# Altium project CW308T_STM32F415_CSP.PrjPcb
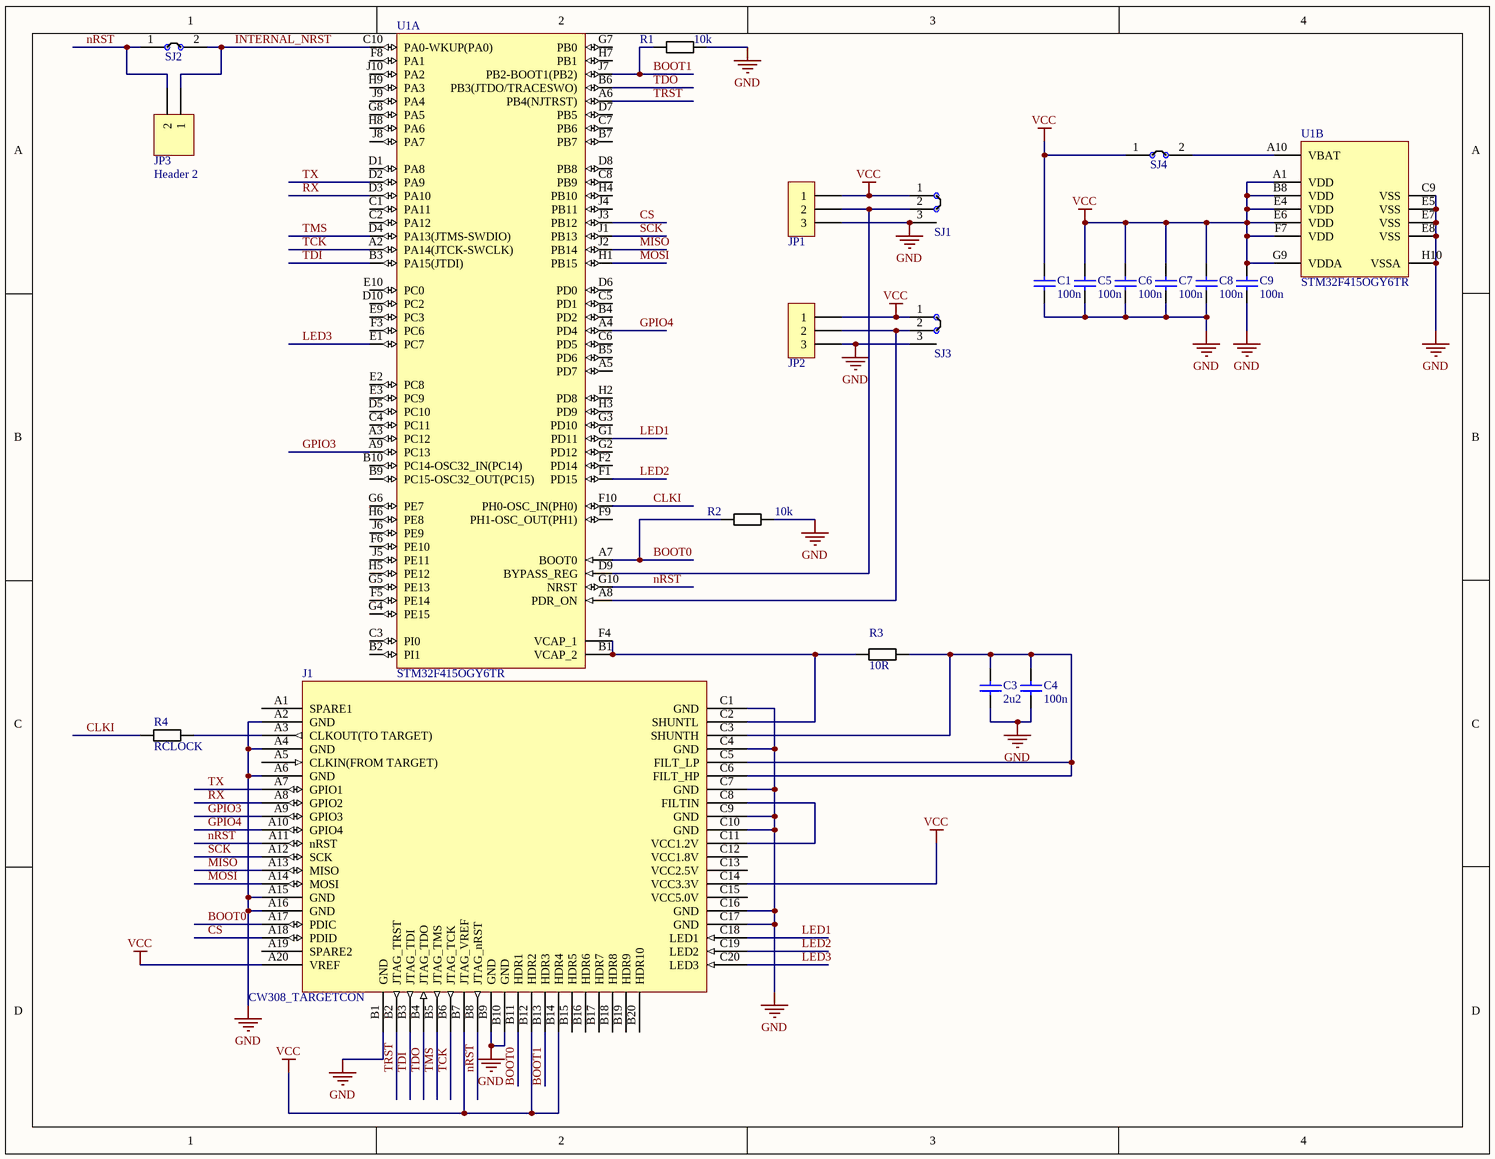
[diagram p0: CW308T_STM32F415_Micro.SchDoc]
PrjLicense: GPL; PrjName: STM32F 64QFP Target; PrjRev: 03
1 sheet, 21 parts. Net scope: global (net labels, ports and power ports of the same name join across sheets).
Board files: CW308T_STM32F415_CSP.PcbDoc, CW308T_STM32415_PANEL.PcbDoc

## Sheet CW308T_STM32F415_Micro.SchDoc: STM32F UFO Target
size Letter; Organization: NewAE Technology Inc.; Address1: 1083 Queen St., Suite 196; Address2: Halifax; Address3: NS; Address4: Canada B3H 0B2; SheetApproved: YES

### Parts
C1  100n  [CAPC0603_M]
C3  2u2  [CAPC0603_M]
C4  100n  [CAPC0603_M]
C5  100n  [CAPC0603_M]
C6  100n  [CAPC0603_M]
C7  100n  [CAPC0603_M]
C8  100n  [CAPC0603_M]
C9  100n  [CAPC0603_M]
J1  CW308_TARGETCON  [CW308_SMD_TBOARD_CONN_BOTTOM]
JP1  Straight Header Pins  [1x3_SMD_Straight_pins]  (value not drawn)
JP2  Straight Header Pins  [1x3_SMD_Straight_pins]  (value not drawn)
JP3  Header 2  [1x2_SMD_Straight_pins]
R1  10k  [RESC1608X55N]
R2  10k  [RESC1608X55N]
R3  10R  [RESC1608X55N]
R4  RCLOCK  [RESC1608X55N]
SJ1  NC  [SJ_3S_NC12]  (value not drawn)  (no BOM)
SJ2  NC  [SJ_2S_NC]  (value not drawn)  (no BOM)
SJ3  NC  [SJ_3S_NC12]  (value not drawn)  (no BOM)
SJ4  NC  [SJ_2S_NC]  (value not drawn)  (no BOM)
U1  STM32F415OGY6TR  [STM-WLCSP90]  (parts A,B of 2)

### Nets
GND: C1.2 C3.2 C4.2 C5.2 C6.2 C7.2 C8.2 C9.2 J1.A2(GND) J1.A4(GND) J1.A6(GND) J1.A15(GND) J1.A16(GND) J1.B1(GND) J1.B9(GND) J1.B10(GND) J1.C1(GND) J1.C4(GND) J1.C7(GND) J1.C9(GND) J1.C10(GND) J1.C16(GND) J1.C17(GND) JP1.3 JP2.3 R1.2 R2.2 SJ1.3 SJ3.3 U1.C9(VSS) U1.E5(VSS) U1.E7(VSS) U1.E8(VSS) U1.H10(VSSA)
VCC: C1.1 C5.1 C6.1 C7.1 C8.1 C9.1 J1.A20(VREF) J1.B7(JTAG_VREF) J1.B12(HDR2) J1.B14(HDR4) J1.C14(VCC3.3V) JP1.1 JP2.1 SJ1.1 SJ3.1 SJ4.1 U1.A1(VDD) U1.B8(VDD) U1.E4(VDD) U1.E6(VDD) U1.F7(VDD) U1.G9(VDDA)
BOOT0: J1.A17(PDIC) J1.B11(HDR1) R2.1 U1.A7(BOOT0)
BOOT1: J1.B13(HDR3) R1.1 U1.J7(PB2-BOOT1(PB2))
CLKI: R4.1 U1.F10(PH0-OSC_IN(PH0))
CS: J1.A18(PDID) U1.J3(PB12)
GPIO3: J1.A9(GPIO3) U1.A9(PC13)
GPIO4: J1.A10(GPIO4) U1.A4(PD4)
INTERNAL_NRST: JP3.1 SJ2.2 U1.C10(PA0-WKUP(PA0))
LED1: J1.C18(LED1) U1.G1(PD11)
LED2: J1.C19(LED2) U1.F1(PD15)
LED3: J1.C20(LED3) U1.E1(PC7)
MISO: J1.A13(MISO) U1.J2(PB14)
MOSI: J1.A14(MOSI) U1.H1(PB15)
nRST: J1.A11(nRST) J1.B8(JTAG_nRST) JP3.2 SJ2.1 U1.G10(NRST)
RX: J1.A8(GPIO2) U1.D3(PA10)
SCK: J1.A12(SCK) U1.J1(PB13)
TCK: J1.B6(JTAG_TCK) U1.A2(PA14(JTCK-SWCLK))
TDI: J1.B3(JTAG_TDI) U1.B3(PA15(JTDI))
TDO: J1.B4(JTAG_TDO) U1.B6(PB3(JTDO/TRACESWO))
TMS: J1.B5(JTAG_TMS) U1.D4(PA13(JTMS-SWDIO))
TRST: J1.B2(JTAG_TRST) U1.A6(PB4(NJTRST))
TX: J1.A7(GPIO1) U1.D2(PA9)
NetC3_1: C3.1 C4.1 J1.C3(SHUNTH) J1.C5(FILT_LP) J1.C6(FILT_HP) R3.2
NetJ1_A3: J1.A3(CLKOUT(TO_TARGET)) R4.2
NetJ1_C2: J1.C2(SHUNTL) R3.1 U1.B1(VCAP_2) U1.F4(VCAP_1)
NetJ1_C8: J1.C8(FILTIN) J1.C11(VCC1.2V)
NetJP1_2: JP1.2 SJ1.2 U1.D9(BYPASS_REG)
NetJP2_2: JP2.2 SJ3.2 U1.A8(PDR_ON)
NetSJ4_2: SJ4.2 U1.A10(VBAT)

Not connected (* = marked no-connect by the designer): J1 A1(SPARE1) A5(CLKIN(FROM_TARGET)) A19(SPARE2) B15(HDR5) B16(HDR6) B17(HDR7) B18(HDR8) B19(HDR9) B20(HDR10) C12(VCC1.8V) C13(VCC2.5V) C15(VCC5.0V); U1 A3(PC12) A5(PD7) B2(PI1) B4(PD2) B5(PD6) B7(PB7) B9(PC15-OSC32_OUT(PC15)) B10(PC14-OSC32_IN(PC14)) C1(PA11) C2(PA12) C3(PI0) C4(PC11) C5(PD1) C6(PD5) C7(PB6) C8(PB9) D1(PA8) D5(PC10) D6(PD0) D7(PB5) D8(PB8) D10(PC2) E2(PC8) E3(PC9) E9(PC3) E10(PC0) F2(PD14) F3(PC6) F5(PE14) F6(PE10) F8(PA1) F9(PH1-OSC_OUT(PH1)) G2(PD12) G3(PD10) G4(PE15) G5(PE13) G6(PE7) G7(PB0) G8(PA5) H2(PD8) H3(PD9) H4(PB10) H5(PE12) H6(PE8) H7(PB1) H8(PA6) H9(PA3) J4(PB11) J5(PE11) J6(PE9) J8(PA7) J9(PA4) J10(PA2)

### Library data of the parts
C1 C4-C9 = CCHIP-100n-0603: 100n, 0603; Component Group: Capacitor; Case-EIA: 0603; Case-Metric: 1608; Part Number: CCHIP-100n-0603; Footprint: 0603; Pin Count: 2; Value: 100n; Mounting Technology: SMT; Component Kind: Standard; Component Type: Standard
C3 = CCHIP-2u2-0603: 2u2, 0603; Component Group: Capacitor; Case-EIA: 0603; Case-Metric: 1608; Part Number: CCHIP-2u2-0603; Footprint: 0603; Pin Count: 2; Value: 2u2; Mounting Technology: SMT; Component Kind: Standard; Component Type: Standard
J1 = CW308_TBOARD: CW308 "Standard" Target Board Connector; Component Group: Mechanical; Pitch: 2.54mm; Part Number: CW308_TBOARD; Pin Count: 60; Mounting Technology: Through-hole; Component Kind: Standard; Component Type: Standard
JP1 JP2 = HDR_3PIN: 1x3 Straight pin header; Manufacture 1: Wurth Electronics Inc.; Manufacture Part Number 1: 61300311121; Component Group: Connector; PP Material Stack: 0; Part Number: HDR_3PIN; Footprint: 1x3_Straight_pins; Pin Count: 3; Supplier 1: Digi-Key; Supplier Part Number 1: 732-5316-ND; Mounting Technology: Through-hole; RoHS: Yes; Component Kind: Standard; Component Type: Standard; PP Rotation: 0
JP3 = Header 2: Header, 2-Pin; LatestRevisionDate: 17-Jul-2002; LatestRevisionNote: Re-released for DXP Platform.; Publisher: Altium Limited
R1 R2 = RCHIP-10K-0603: 10k res, 0603, 1%, 1/10W; Manufacture 1: Yageo; Manufacture Part Number 1: RC0603FR-0710KL; Component Group: Resistor; Case-EIA: 0603; Case-Metric: 1608; Rated Power: 0.1W; Rated Voltage: 75VDC; Part Number: RCHIP-10K-0603; Footprint: 0603; Pin Count: 2; Supplier 1: Digi-Key; Supplier Part Number 1: 311-10.0KHRCT-ND; Value: 10k; Tolerance: 1%; Mounting Technology: SMT; Temperature Range: -55C to 155C; Component Kind: Standard; Component Type: Standard
R3 = RCHIP-10R-0603: 10R res, 0603, 1%, 1/10W; Manufacture 1: Yageo; Manufacture Part Number 1: RC0603FR-0710RL; Component Group: Resistor; Case-EIA: 0603; Case-Metric: 1608; Rated Power: 0.1W; Rated Voltage: 75VDC; Part Number: RCHIP-10R-0603; Footprint: 0603; Pin Count: 2; Supplier 1: Digi-Key; Supplier Part Number 1: 311-10.0HRCT-ND; Value: 10R; Tolerance: 1%; Mounting Technology: SMT; Temperature Range: -55C to 155C; Component Kind: Standard; Component Type: Standard
R4 = RCHIP-100R-0603: 100R res, 0603, 1%, 1/10W; Manufacture 1: Yageo; Manufacture Part Number 1: RC0603FR-07100RL; Component Group: Resistor; Case-EIA: 0603; Case-Metric: 1608; Rated Power: 0.1W; Rated Voltage: 75VDC; Part Number: RCHIP-100R-0603; Footprint: 0603; Pin Count: 2; Supplier 1: Digi-Key; Supplier Part Number 1: 311-100HRCT-ND; Value: 100R; Tolerance: 1%; Mounting Technology: SMT; Temperature Range: -55C to 155C; Component Kind: Standard; Component Type: Standard
SJ1 SJ3 = SJ_3S_12JMP: Solder Jumper, NC; Component Group: PCB Feature; Part Number: SJ_3S_12JMP; Pin Count: 3; Mounting Technology: COPPER; Component Type: Standard (No BOM)
SJ2 SJ4 = SJ_2S: Solder Jumper, NC; Component Group: PCB Feature; Part Number: SJ_2S; Pin Count: 2; Mounting Technology: COPPER; Component Type: Standard (No BOM)
U1 = CMP-0243-00132-2: ARM Cortex-M4 32-bit MCU+FPU, 210 DMIPS, 1024 kB Flash, 192 kB Internal RAM, 72 I/Os, 90-pin WLCSP, -40 to 85 degC, Tape and Reel; Manufacturer: STMicroelectronics; I/Os (High Current): 72; Supply Voltage(Vcc) max (V): 3.6; Supply Voltage(Vcc) min (V): 1.8; FLASH Size (Prog) (kB): 1024; D/A Converter: 2x12-bit; Internal RAM Size (kB): 192; Operating Frequency(F) (Processor speed) (MHz): 168; PartNumber: STM32F415OGY6TR; Core: ARM Cortex-M4; Mounting Technology: Surface Mount; Packing: Tape and Reel; PackageDescription: 90-Ball Wafer Level Chip Size Package, 0.4 mm Pitch; ComponentLink1URL: http://www.st.com/web/en/home.html; PackageReference: WLCSP90; ComponentLink3URL: http://www.st.com/st-web-ui/static/active/en/resource/technical/document/datasheet/DM00035129.pdf; ComponentLink3Description: Package Specification; DatasheetVersion: Rev. 4; ComponentLink2Description: Datasheet; PackageVersion: Rev. 4, 06/2013; ComponentLink1Description: Manufacturer URL; ComponentLink2URL: http://www.st.com/st-web-ui/static/active/en/resource/technical/document/datasheet/DM00035129.pdf